# EAGLE design In-Circuit (EAGLE 5.11)
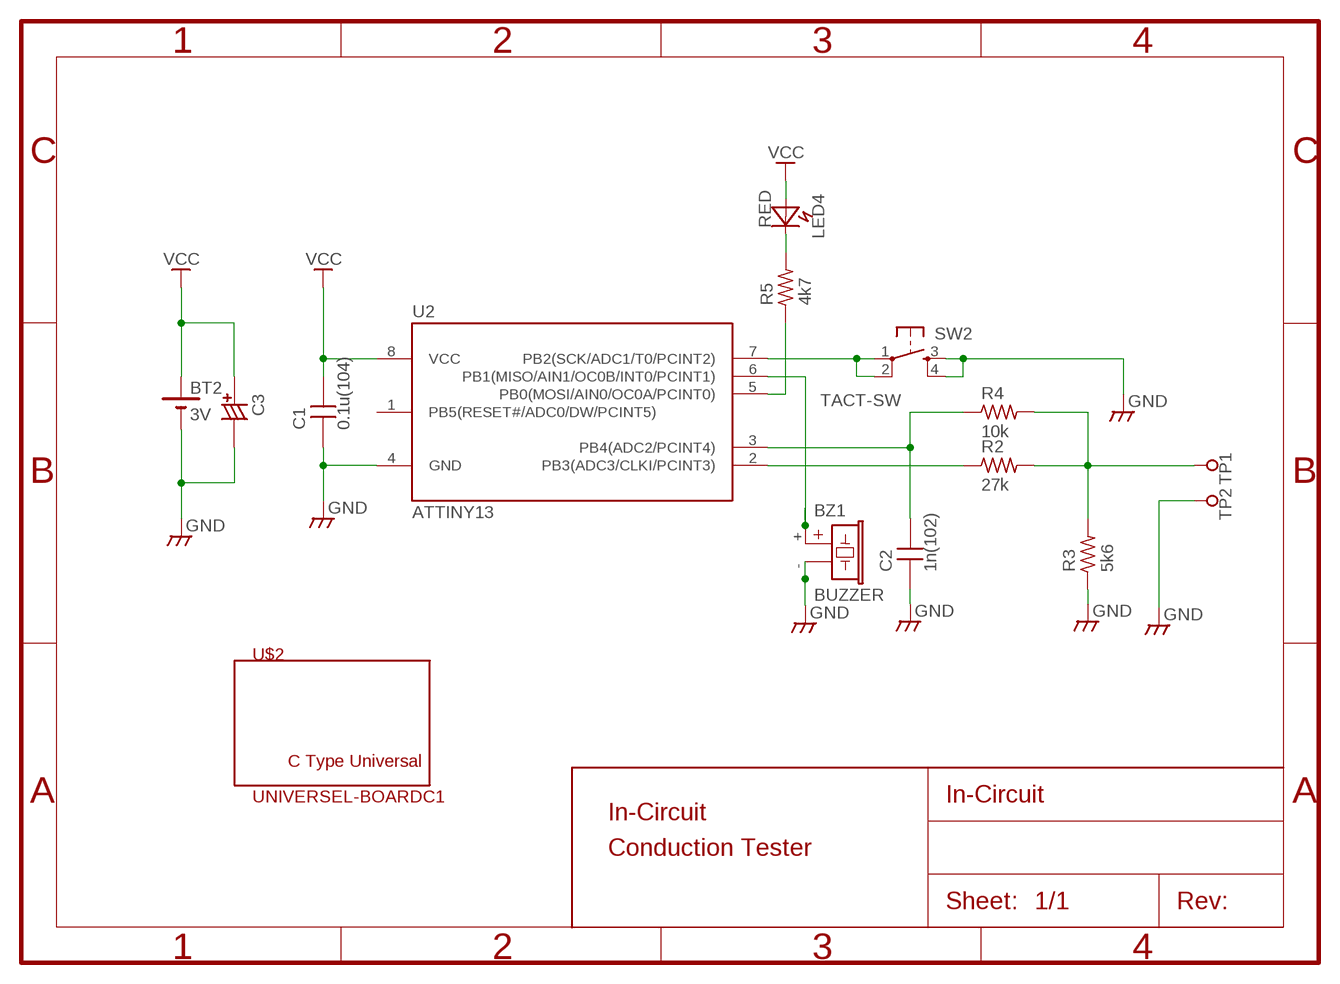
[diagram p0: schematic, sheet 1]

## Parts
BT2  3V  BAT-CH25  [CH25-2032]
BZ1  BUZZER  [SPL29M]
C1  0.1u(104)  CAPDIP_2  [CAP_DIP_2]
C2  1n(102)  CAPDIP_2  [CAP_DIP_2]
C3  CCAP6.5  [CCAP_6.5]
LED4  RED  LED  [LED_3MM_VIRT_2]
R2  27k  R0.125W_4P  [R_0.125W_4]
R3  5k6  R0.125W_4P  [R_0.125W_4]
R4  10k  R0.125W_4P  [R_0.125W_4]
R5  4k7  R0.125W_4P  [R_0.125W_4]
SW2  TACT-SW  [B3F-10X]
TP1  TP1  TP1O  [TP1-O]
TP2  TP1  TP1O  [TP1-O]
U2  ATTINY13  TINY138P3  [DIL08]
U$2  UNIVERSEL-BOARDC1  [C-TYPE-BOARD]

## Nets
GND: BT2.P$2(-) BZ1.- C1.1 C2.1 C3.- R3.1 SW2.3(S) SW2.4(S1) TP2.P$1 U2.4(GND)
N$1: R2.1 U2.2(PB3(ADC3/CLKI/PCINT3))
N$2: C2.2 R4.1 U2.3(PB4(ADC2/PCINT4))
N$5: R5.1 U2.5(PB0(MOSI/AIN0/OC0A/PCINT0))
N$6: LED4.K R5.2
N$7: BZ1.+ U2.6(PB1(MISO/AIN1/OC0B/INT0/PCINT1))
N$8: SW2.1(P) SW2.2(P1) U2.7(PB2(SCK/ADC1/T0/PCINT2))
N$9: R2.2 R3.2 R4.2 TP1.P$1
VCC: BT2.P$1(+) C1.2 C3.+ LED4.A U2.8(VCC)
Unconnected: U2.1(PB5(RESET#/ADC0/DW/PCINT5))

## Notes on the sheet
- In-Circuit
- Conduction Tester

## Library data of the parts
BT2 = battery:BAT
BZ1 = buzzer:BUZZER: Piezo Buzzer
C1 C2 = MyLib:CAP: Non polar capacitor
C3 = MyLib:CCAP: Polar capacitor
LED4 = MyLib:LED: 3mm LED
R2-R5 = MyLib:R: General Resiter 1/8W 1/4W 1/2W V/H
SW2 = MyLib:TACT-SW: Tacticle Push Switch
TP1 TP2 = MyLib:TP1: 1 Pin Test Point
U2 = atmel:TINY13*
U$2 = bant:UNIVERSEL-BOARD

## Board
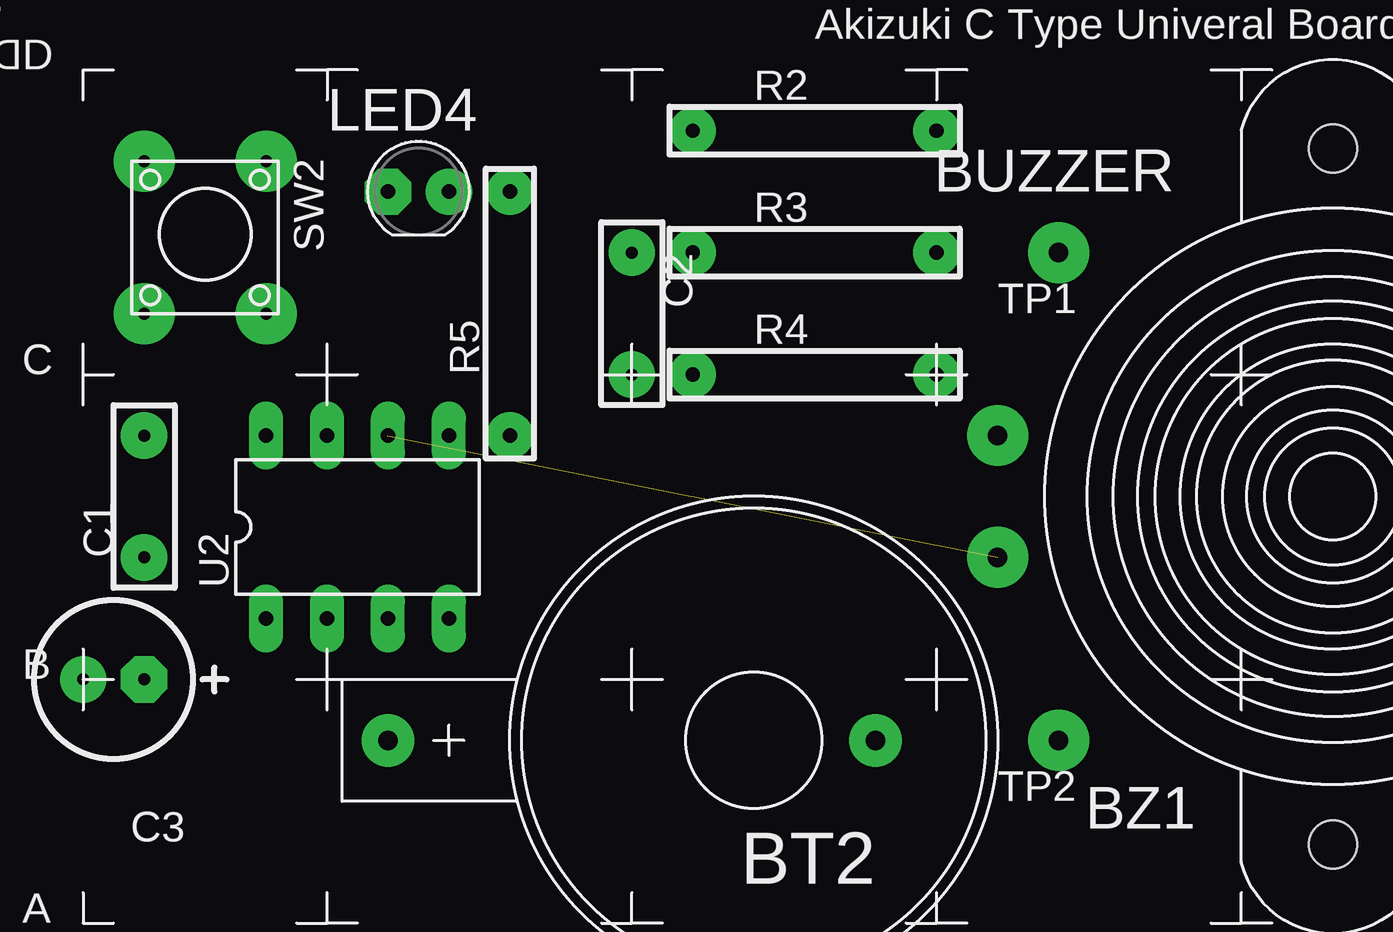
[diagram p1: board, top side]
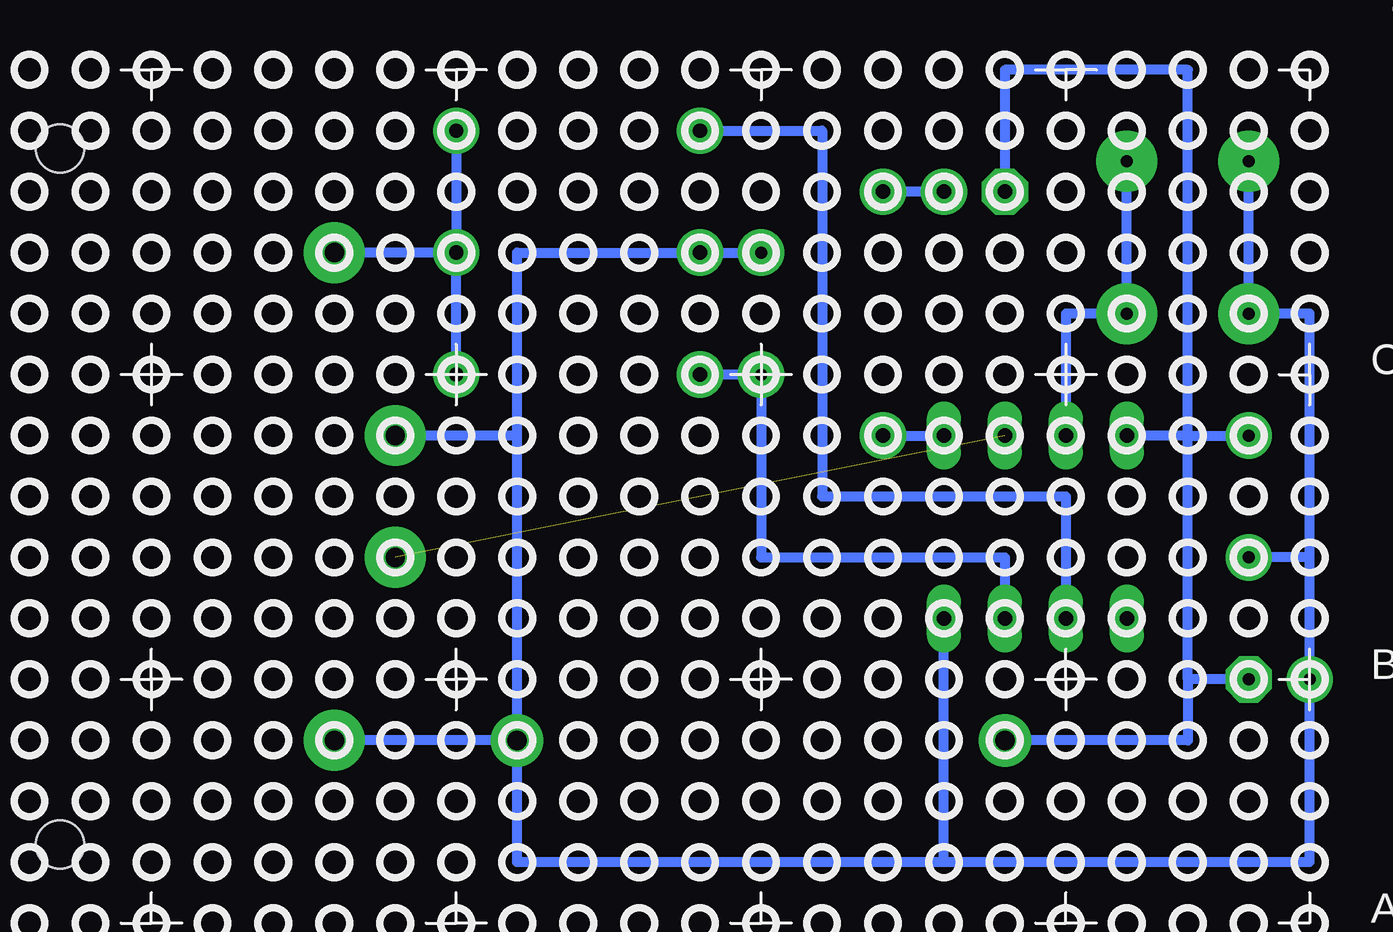
[diagram p2: board, bottom side, seen from below]

No outline drawn. Coordinates in mm, seen from the top.
Copper layers (1*16): Top 0.035mm / dielectric 1.5mm / Bottom 0.035mm
Design rules "default": minimum track width 10mil, minimum drill 24mil, track to track 8mil, track to pad 8mil, pad to pad 8mil, via to via 8mil, smd to smd 8mil, copper to edge 40mil, drill to drill 8mil, minimum pad ring 10mil, minimum via ring 8mil, stop-mask expansion 4mil, vias tented up to drill 0mil, thermal gap 10mil

### Footprints (pad centres in the part's own frame; a part is rotated, then mirrored left to right if it is on the bottom)
CH25-2032 = drill 0.813 pad 2.184 round: P$1 15.24,0; P$2 -5.08,0
SPL29M = drill 0.8 pad 2.54 round: + 13.97,2.54; - 13.97,-2.54 | hole 2: 0,14.5; 0,-14.5
CAP_DIP_2 = drill 0.5 pad 1.93 round: 1 -2.54,0; 2 2.54,0
CCAP_6.5 = drill 0.5 pad 1.93 octagon: + -1.27,0 | drill 0.5 pad 1.93 round: - 1.27,0
LED_3MM_VIRT_2 = drill 0.6 pad 1.93 octagon: A -1.27,0 | drill 0.6 pad 1.93 round: K 1.27,0
R_0.125W_4 = drill 0.6 pad 1.93 round: 1 -5.08,0; 2 5.08,0
B3F-10X = drill 0.5 pad 2.54 round: 1 -1.27,2.54; 2 5.08,2.54; 3 -1.27,-2.54; 4 5.08,-2.54
TP1 = drill 0.813 pad 2.54 round: P$1 0,0
DIL08 = drill 0.6 pad 1.422 long: 1 -3.81,-3.81; 2 -1.27,-3.81; 3 1.27,-3.81; 4 3.81,-3.81; 5 3.81,3.81; 6 1.27,3.81; 7 -1.27,3.81; 8 -3.81,3.81
C-TYPE-BOARD = hole 0.6: 2.54,2.54; 2.54,44.45; 69.85,44.45; 69.85,2.54

### Placement (x,y rotation side)
BT2  34.29,13.97 180 top
BZ1  58.42,24.13 180 top
C1  8.89,24.13 90 top
C2  29.21,31.75 270 top
C3  7.62,16.51 180 top
LED4  20.32,36.83 0 top
R2  36.83,39.37 0 top
R3  36.83,34.29 0 top
R4  36.83,29.21 0 top
R5  24.13,31.75 90 top
SW2  11.43,36.83 270 top
TP1  TP1  [TP1]  46.99,34.29 0 top
TP2  TP1  [TP1]  46.99,13.97 0 top
U2  17.78,22.86 0 top
U$2  0,0 0 top

### Tracks (layer width: path | path; a pad name or v marks a point on that pad's centre or on a via)
GND
  Bottom 0.406: C2.1 R3.1 39.37,34.29 39.37,26.67 | SW2.3 SW2.4 6.35,31.75 6.35,21.59 | 6.35,21.59 C3.- 6.35,15.24 6.35,8.89 21.59,8.89 | 21.59,8.89 39.37,8.89 BT2.P$2 | 6.35,21.59 C1.1 | 21.59,8.89 U2.4 | BT2.P$2 39.37,26.67 | BT2.P$2 TP2.P$1 | 39.37,26.67 BZ1.-
N$1
  Bottom 0.406: R2.1 26.67,39.37 26.67,24.13 16.51,24.13 U2.2
N$2
  Bottom 0.406: R4.1 C2.2 29.21,21.59 19.05,21.59 U2.3
N$5
  Bottom 0.406: R5.1 U2.5
N$6
  Bottom 0.406: LED4.K R5.2
N$7  (1 unrouted)
N$8
  Bottom 0.406: SW2.1 SW2.2 16.51,31.75 U2.7
N$9
  Bottom 0.406: R3.2 TP1.P$1 | R4.2 R3.2 | R2.2 R3.2
VCC
  Bottom 0.406: 11.43,26.67 C1.2 | 11.43,26.67 U2.8 | BT2.P$1 11.43,13.97 11.43,15.24 11.43,16.51 | 11.43,16.51 11.43,26.67 | LED4.A 19.05,41.91 11.43,41.91 11.43,26.67 | C3.+ 11.43,16.51